# EAGLE design LowVoltageShutdown (EAGLE 9.0.0)
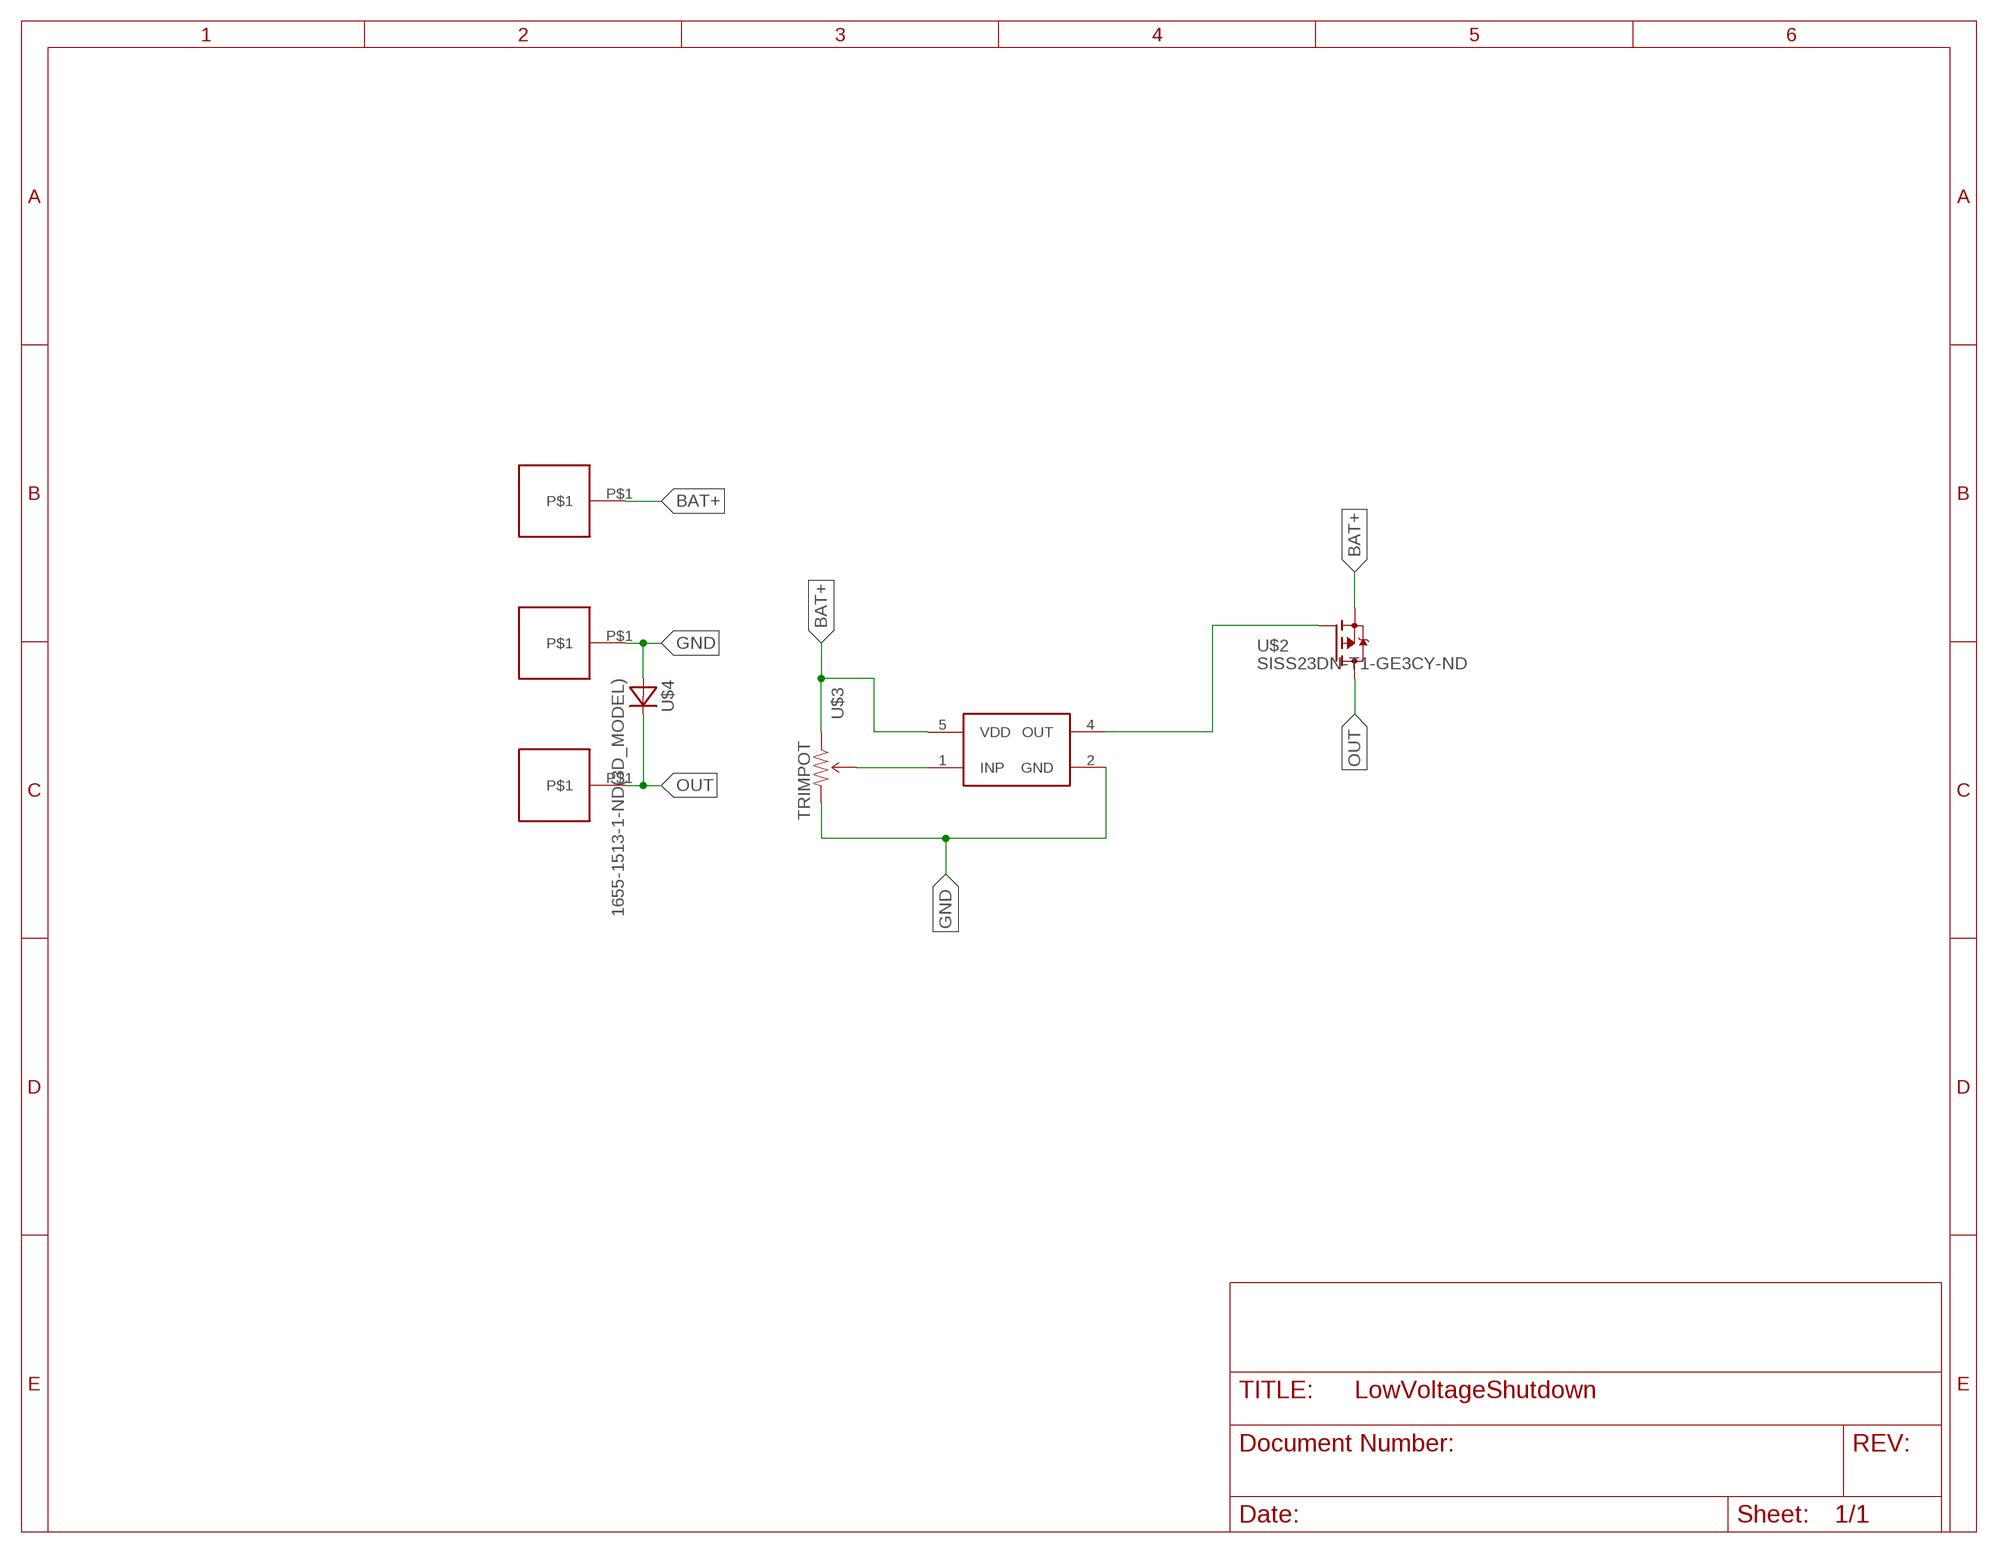
[diagram p0: schematic, sheet 1]

## Parts
BAT+  16G  [16G]
GND  16G  [16G]
OUT  16G  [16G]
U$1  MIC842L(3D_MODEL)  [SOTFL65P210X110-5]
U$2  SISS23DN-T1-GE3CY-ND  [POWERPAK1212-8S]
U$3  TRIMPOT  [490-2877-ND]
U$4  1655-1513-1-ND(3D_MODEL)  [DIOAD1950W130L900D530B]

## Nets
BAT+: BAT+.P$1 U$1.5(VDD) U$2.S U$3.P$1(CCW)
GND: GND.P$1 U$1.2(GND) U$3.P$3(CW) U$4.2(A)
N$1: U$1.1(INP) U$3.P$2(WIPER)
N$5: U$1.4(OUT) U$2.G
OUT: OUT.P$1 U$2.D U$4.1(C)

## Library data of the parts
BAT+ GND OUT = Wire2Board:16G
U$1 = MIC842L:MIC842L(3D_MODEL)
U$2 = SISS23DN-T1-GE3CT-ND:SISS23DN-T1-GE3CY-ND
U$3 = trimpot:TRIMPOT
U$4 = 1655-1513-1-ND:1655-1513-1-ND(3D_MODEL)

## Board
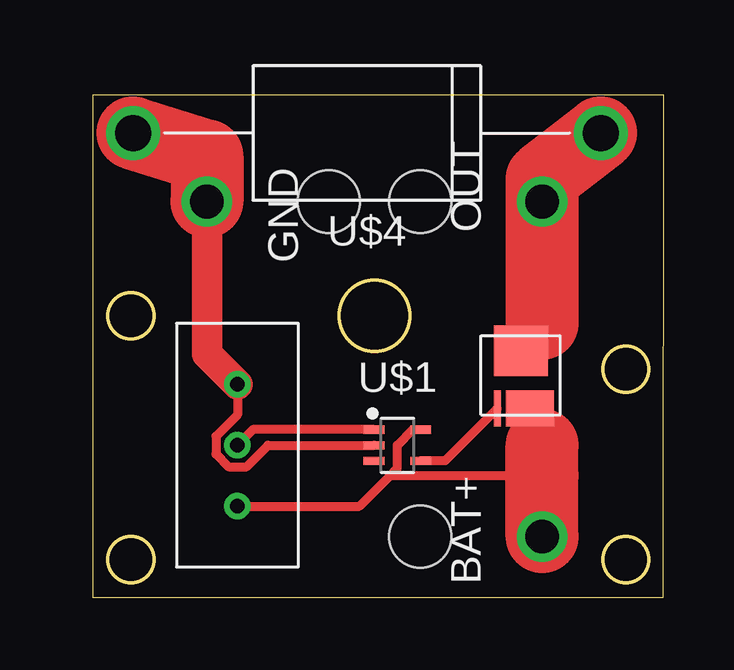
[diagram p1: board, top side]

Size 23.81 x 20.95 mm. Coordinates in mm from the lower left corner, seen from the top.
Outline: 0,0 23.79,0 23.81,20.95 0,20.95 0,0
Outline: circle at 11.75,11.75 radius 1.47
Outline: circle at 1.59,11.75 radius 0.95
Outline: circle at 1.59,1.59 radius 0.95
Outline: circle at 22.23,1.59 radius 0.95
Outline: circle at 22.23,9.53 radius 0.95
Copper layers (1*16): Top 0.035mm / dielectric 1.5mm / Bottom 0.035mm
Design rules "default": minimum track width 6mil, minimum drill 0.35mm, track to track 6mil, track to pad 6mil, pad to pad 6mil, via to via 6mil, smd to smd 6mil, copper to edge 40mil, drill to drill 6mil, minimum pad ring 10mil, minimum via ring 8mil, stop-mask expansion 4mil, vias tented up to drill 0mil, thermal gap 10mil

### Footprints (pad centres in the part's own frame; a part is rotated, then mirrored left to right if it is on the bottom)
16G = drill 1.4: P$1 0,0 | hole 2.6: 5.08,0
SOTFL65P210X110-5 = smd 0.869 x 0.337: 1 -0.971,0.65; 2 -0.971,0; 3 -0.971,-0.65; 4 0.971,-0.65; 5 0.971,0.65
POWERPAK1212-8S = smd 2.25 x 2.11: D 1.65,2.667 | smd 0.3 x 1.5: G 0.675,0.254 | smd 2 x 1.5: S 2.031,0.254
490-2877-ND = drill 0.6: P$1 0,-2.54; P$2 0,0; P$3 0,2.54
DIOAD1950W130L900D530B = drill 1.5 pad 2.1: 1 -9.75,0; 2 9.75,0

### Placement (x,y rotation side)
BAT+  18.73,2.54 180 top
GND  4.76,16.51 0 top
OUT  18.73,16.51 180 top
U$1  12.7,6.35 0 top
U$2  16.19,7.62 0 top
U$3  6.03,6.35 0 top
U$4  11.43,19.37 180 top

### Tracks (layer width: path | path; a pad name or v marks a point on that pad's centre or on a via)
BAT+
  Top 0.381: U$3.P$1 11.11,3.81 12.38,5.08 | 12.38,5.08 12.7,5.4 12.7,6.35 13.35,7 U$1.5 | 18.73,5.08 12.38,5.08
  Top 1.27: 18.73,6.35 18.73,7.37 U$2.S
  Top 3.048: BAT+.P$1 18.73,5.08 18.73,6.35
GND
  Top 0.381: U$3.P$3 6.03,7.62 5.14,6.72 5.14,5.98 5.66,5.45 6.4,5.45 7.3,6.35 U$1.2
  Top 1.27: GND.P$1 4.76,10.16 U$3.P$3
  Top 3.048: U$4.2 4.76,18.41 GND.P$1
N$1
  Top 0.381: U$1.1 6.68,7 U$3.P$2
N$5
  Top 0.381: U$2.G 14.69,5.7 U$1.4
OUT
  Top 1.27: 18.73,11.43 18.73,11.18 U$2.D
  Top 3.048: 18.73,11.43 OUT.P$1 18.73,17.46 U$4.1